# EAGLE design FlashAdapter_sfc (EAGLE 7.6.0)
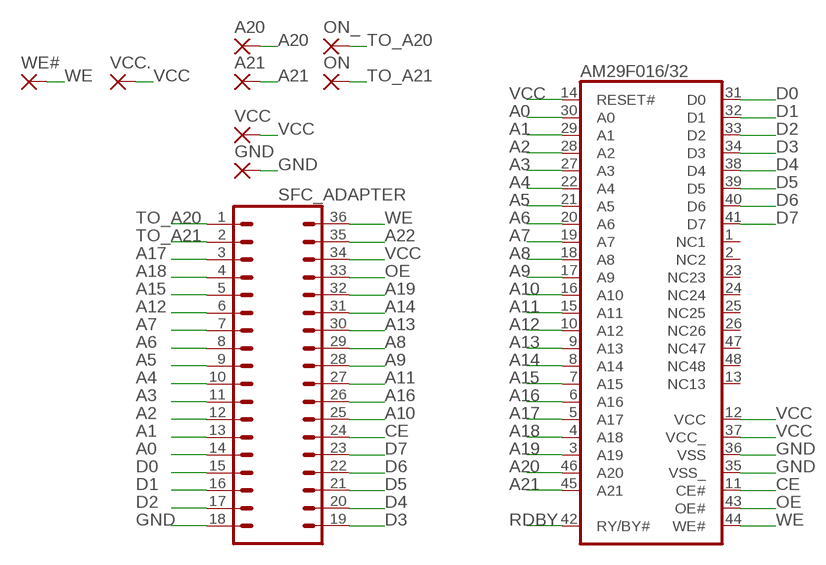
[diagram p0: schematic, sheet 1]

## Parts
A20  SMD2  [SMD1,27-2,54]
A21  SMD2  [SMD1,27-2,54]
AM29F016/32  AM29F016  [TSOP48]
GND  SMD2  [SMD1,27-2,54]
ON  SMD2  [SMD1,27-2,54]
ON_  SMD2  [SMD1,27-2,54]
SFC_ADAPTER  DIP36PTH  [DIP36]
VCC  SMD2  [SMD1,27-2,54]
VCC.  SMD2  [SMD1,27-2,54]
WE#  SMD2  [SMD1,27-2,54]

## Nets
A0: AM29F016/32.30(A0) SFC_ADAPTER.14
A1: AM29F016/32.29(A1) SFC_ADAPTER.13
A2: AM29F016/32.28(A2) SFC_ADAPTER.12
A3: AM29F016/32.27(A3) SFC_ADAPTER.11
A4: AM29F016/32.22(A4) SFC_ADAPTER.10
A5: AM29F016/32.21(A5) SFC_ADAPTER.9
A6: AM29F016/32.20(A6) SFC_ADAPTER.8
A7: AM29F016/32.19(A7) SFC_ADAPTER.7
A8: AM29F016/32.18(A8) SFC_ADAPTER.29
A9: AM29F016/32.17(A9) SFC_ADAPTER.28
A10: AM29F016/32.16(A10) SFC_ADAPTER.25
A11: AM29F016/32.15(A11) SFC_ADAPTER.27
A12: AM29F016/32.10(A12) SFC_ADAPTER.6
A13: AM29F016/32.9(A13) SFC_ADAPTER.30
A14: AM29F016/32.8(A14) SFC_ADAPTER.31
A15: AM29F016/32.7(A15) SFC_ADAPTER.5
A16: AM29F016/32.6(A16) SFC_ADAPTER.26
A17: AM29F016/32.5(A17) SFC_ADAPTER.3
A18: AM29F016/32.4(A18) SFC_ADAPTER.4
A19: AM29F016/32.3(A19) SFC_ADAPTER.32
A20: A20.1(P) AM29F016/32.46(A20)
A21: A21.1(P) AM29F016/32.45(A21)
A22: SFC_ADAPTER.35
CE: AM29F016/32.11(CE#) SFC_ADAPTER.24
D0: AM29F016/32.31(D0) SFC_ADAPTER.15
D1: AM29F016/32.32(D1) SFC_ADAPTER.16
D2: AM29F016/32.33(D2) SFC_ADAPTER.17
D3: AM29F016/32.34(D3) SFC_ADAPTER.19
D4: AM29F016/32.38(D4) SFC_ADAPTER.20
D5: AM29F016/32.39(D5) SFC_ADAPTER.21
D6: AM29F016/32.40(D6) SFC_ADAPTER.22
D7: AM29F016/32.41(D7) SFC_ADAPTER.23
GND: AM29F016/32.35(VSS_) AM29F016/32.36(VSS) GND.1(P) SFC_ADAPTER.18
OE: AM29F016/32.43(OE#) SFC_ADAPTER.33
RDBY: AM29F016/32.42(RY/BY#)
TO_A20: ON_.1(P) SFC_ADAPTER.1
TO_A21: ON.1(P) SFC_ADAPTER.2
VCC: AM29F016/32.12(VCC) AM29F016/32.14(RESET#) AM29F016/32.37(VCC_) SFC_ADAPTER.34 VCC.1(P) VCC..1(P)
WE: AM29F016/32.44(WE#) SFC_ADAPTER.36 WE#.1(P)
Unconnected: AM29F016/32.1(NC1) AM29F016/32.2(NC2) AM29F016/32.13(NC13) AM29F016/32.23(NC23) AM29F016/32.24(NC24) AM29F016/32.25(NC25) AM29F016/32.26(NC26) AM29F016/32.47(NC47) AM29F016/32.48(NC48)

## Library data of the parts
A20 A21 GND ON ON_ VCC VCC. WE# = wirepad:SMD2: SMD PAD
AM29F016/32 = Chip_AM29F016:AM29F016: 4-Megabit FLASH MEMORY (512 K x 8 bit/256 K x 16 bit) 5 V-only
SFC_ADAPTER = Adapter_DIP36:DIP36: 1x16 .1" header

## Board
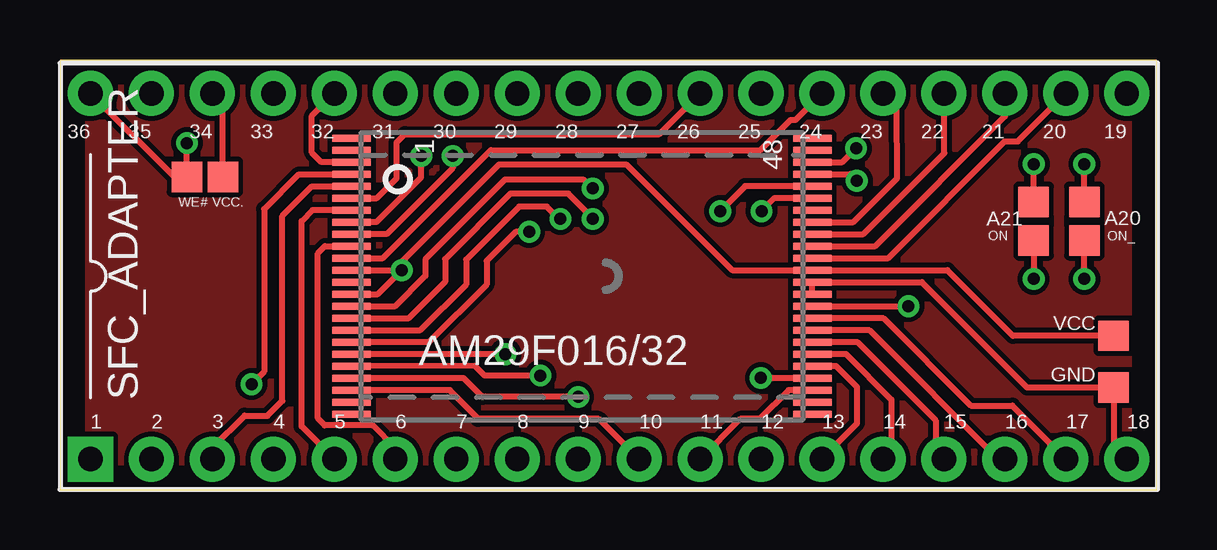
[diagram p1: board, top side]
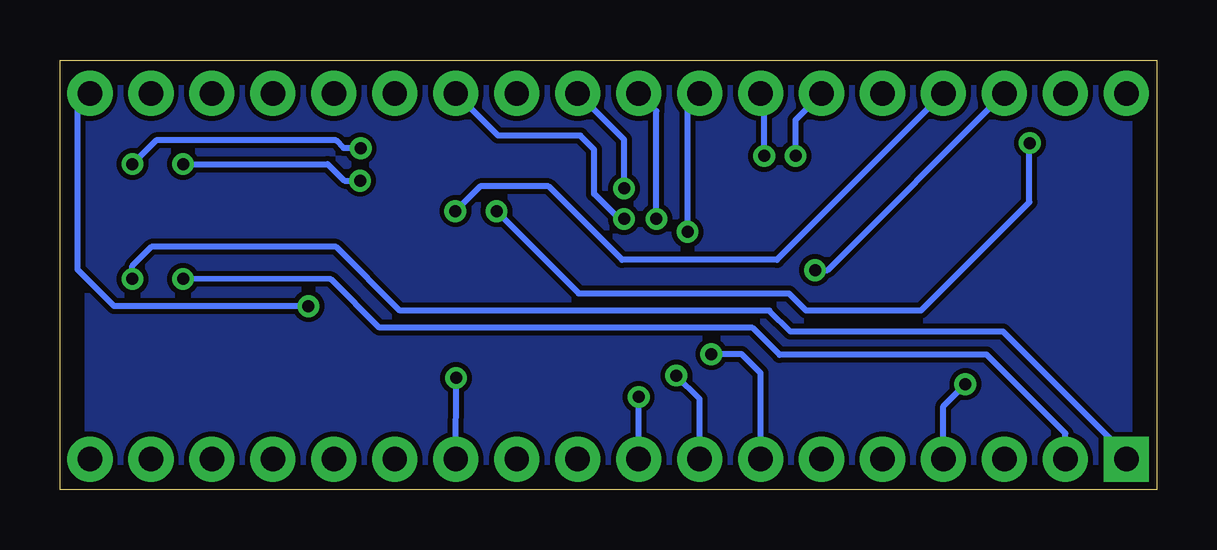
[diagram p2: board, bottom side, seen from below]

Size 45.7 x 17.9 mm. Coordinates in mm from the lower left corner, seen from the top.
Outline: 0,0 45.7,0 45.7,17.9 0,17.9 0,0
Copper layers (1*16): Top 0.035mm / dielectric 1.5mm / Bottom 0.035mm
Design rules "default": minimum track width 10mil, minimum drill 24mil, track to track 8mil, track to pad 8mil, pad to pad 8mil, via to via 8mil, smd to smd 8mil, copper to edge 40mil, drill to drill 8mil, minimum pad ring 10mil, minimum via ring 8mil, stop-mask expansion 4mil, vias tented up to drill 0mil, thermal gap 10mil

### Footprints (pad centres in the part's own frame; a part is rotated, then mirrored left to right if it is on the bottom)
SMD1,27-2,54 = smd 1.27 x 1.27: 1 0,0
TSOP48 = smd 0.3 x 1.6: 1 -5.75,-9.6; 2 -5.25,-9.6; 3 -4.75,-9.6; 4 -4.25,-9.6; 5 -3.75,-9.6; 6 -3.25,-9.6; 7 -2.75,-9.6; 8 -2.25,-9.6; 9 -1.75,-9.6; 10 -1.25,-9.6; 11 -0.75,-9.6; 12 -0.25,-9.6; 13 0.25,-9.6; 14 0.75,-9.6; 15 1.25,-9.6; 16 1.75,-9.6; 17 2.25,-9.6; 18 2.75,-9.6; 19 3.25,-9.6; 20 3.75,-9.6; 21 4.25,-9.6; 22 4.75,-9.6; 23 5.25,-9.6; 24 5.75,-9.6; 25 5.75,9.6; 26 5.25,9.6; 27 4.75,9.6; 28 4.25,9.6; 29 3.75,9.6; 30 3.25,9.6; 31 2.75,9.6; 32 2.25,9.6; 33 1.75,9.6; 34 1.25,9.6; 35 0.75,9.6; 36 0.25,9.6; 37 -0.25,9.6; 38 -0.75,9.6; 39 -1.25,9.6; 40 -1.75,9.6; 41 -2.25,9.6; 42 -2.75,9.6; 43 -3.25,9.6; 44 -3.75,9.6; 45 -4.25,9.6; 46 -4.75,9.6; 47 -5.25,9.6; 48 -5.75,9.6
DIP36 = drill 1.016 pad 1.88 square: 1 0,0 | drill 1.016 pad 1.88: 2 2.54,0; 3 5.08,0; 4 7.62,0; 5 10.16,0; 6 12.7,0; 7 15.24,0; 8 17.78,0; 9 20.32,0; 10 22.86,0; 11 25.4,0; 12 27.94,0; 13 30.48,0; 14 33.02,0; 15 35.56,0; 16 38.1,0; 17 40.64,0; 18 43.18,0; 19 43.18,15.24; 20 40.64,15.24; 21 38.1,15.24; 22 35.56,15.24; 23 33.02,15.24; 24 30.48,15.24; 25 27.94,15.24; 26 25.4,15.24; 27 22.86,15.24; 28 20.32,15.24; 29 17.78,15.24; 30 15.24,15.24; 31 12.7,15.24; 32 10.16,15.24; 33 7.62,15.24; 34 5.08,15.24; 35 2.54,15.24; 36 0,15.24

### Placement (x,y rotation side)
A20  42.68,11.99 90 top
A21  40.57,11.99 90 top
AM29F016/32  21.75,8.89 270 top
GND  43.9,4.25 90 top
ON  40.57,10.38 270 top
ON_  42.68,10.38 270 top
SFC_ADAPTER  1.27,1.27 0 top
VCC  43.9,6.41 90 top
VCC.  6.79,13.03 270 top
WE#  5.29,13.03 270 top

### Tracks (layer width: path | path; a pad name or v marks a point on that pad's centre or on a via)
A0
  Top 0.254: AM29F016/32.30 32.76,5.64 34.64,3.75 34.64,1.62 SFC_ADAPTER.14
A1
  Top 0.254: SFC_ADAPTER.13 31.75,1.31 33.21,2.77 33.21,4.27 32.34,5.14 AM29F016/32.29
A2  (via drill 0.5)
  Top 0.254: v29.2,4.65 31.34,4.65 AM29F016/32.28
  Bottom 0.254: SFC_ADAPTER.12 v29.2,4.65
A3
  Top 0.254: AM29F016/32.27 31.34,4.15 30.36,4.15 29.16,2.95 28.35,2.95 SFC_ADAPTER.11
A4
  Top 0.254: SFC_ADAPTER.10 24.09,1.3 22.44,2.95 17.42,2.95 16.24,4.14 AM29F016/32.22
A5  (via drill 0.5)
  Top 0.254: v21.59,3.86 17.6,3.86 16.82,4.64 AM29F016/32.21
  Bottom 0.254: SFC_ADAPTER.9 v21.59,3.86
A6  (via drill 0.5)
  Top 0.254: v20.02,4.75 17.69,4.75 17.29,5.15 AM29F016/32.20
  Bottom 0.254: SFC_ADAPTER.8 19.05,3.78 v20.02,4.75
A7  (via drill 0.5)
  Top 0.254: v18.56,5.64 AM29F016/32.19
  Bottom 0.254: SFC_ADAPTER.7 16.51,4.85 17.3,5.64 v18.56,5.64
A8  (via drill 0.5)
  Top 0.254: v19.55,10.74 18.99,10.74 17.78,9.53 17.78,8.54 15.37,6.13 AM29F016/32.18
  Bottom 0.254: v19.55,10.74 19.55,16.01 SFC_ADAPTER.29
A9  (via drill 0.5)
  Top 0.254: v20.85,11.28 20.77,11.31 20.29,11.79 19.13,11.79 16.92,9.58 16.92,8.54 15.02,6.64 AM29F016/32.17
  Bottom 0.254: v20.85,11.28 20.85,15.77 SFC_ADAPTER.28
A10  (via drill 0.5)
  Top 0.254: AM29F016/32.16 14.54,7.14 16.05,8.65 16.05,9.6 18.77,12.33 21.18,12.33 22.2,11.31 v22.2,11.28
  Bottom 0.254: v22.2,11.28 22.4,11.28 23.44,12.32 23.44,14.17 24.02,14.75 27.45,14.75 SFC_ADAPTER.25
A11  (via drill 0.5)
  Top 0.254: AM29F016/32.15 13.96,7.64 15.22,8.9 15.22,9.59 18.55,12.93 21.8,12.93 v22.2,12.55
  Bottom 0.254: v22.2,12.55 22.2,14.58 SFC_ADAPTER.27
A12
  Top 0.254: SFC_ADAPTER.6 13.97,1.73 13.03,2.68 11.03,2.68 10.74,2.97 10.74,9.84 11.04,10.14 AM29F016/32.10
A13  (via drill 0.5)
  Top 0.254: AM29F016/32.9 13.61,10.64 16.36,13.39 v16.36,13.9
  Bottom 0.254: v16.36,13.9 16.36,16.36 SFC_ADAPTER.30
A14  (via drill 0.5)
  Top 0.254: AM29F016/32.8 13.18,11.14 15.05,13.01 v15.05,13.9
  Bottom 0.254: v15.05,13.9 15.05,15.41 SFC_ADAPTER.31
A15
  Top 0.254: SFC_ADAPTER.5 10.07,2.63 10.07,11.19 10.53,11.65 12.14,11.65 AM29F016/32.7
A16
  Top 0.254: SFC_ADAPTER.26 24.97,14.81 14.37,14.81 14.02,14.46 14.02,12.96 13.2,12.14 AM29F016/32.6
A17
  Top 0.254: AM29F016/32.5 12.14,12.63 10.49,12.63 9.27,11.41 9.27,3.7 8.64,3.07 7.69,3.08 6.35,1.74 SFC_ADAPTER.3
A18  (via drill 0.5)
  Top 0.254: AM29F016/32.4 12.14,13.13 9.95,13.13 8.51,11.69 8.51,4.92 v7.98,4.39
  Bottom 0.254: SFC_ADAPTER.4 8.89,3.48 v7.98,4.39
A19
  Top 0.254: AM29F016/32.3 10.89,13.64 10.49,14.04 10.49,15.57 SFC_ADAPTER.32
A20  (via drill 0.5)
  Top 0.254: AM29F016/32.46 32.59,13.64 v33.17,14.22 | A20.1 v42.68,13.56
  Bottom 0.254: v33.17,14.22 v33.16,14.23 33.88,14.23 34.2,14.55 41.7,14.55 v42.68,13.56
A21  (via drill 0.5)
  Top 0.254: A21.1 v40.58,13.56 | AM29F016/32.45 32.92,13.14 v33.2,12.87
  Bottom 0.254: v40.58,13.56 34.55,13.56 33.85,12.87 v33.2,12.87
CE
  Top 0.254: AM29F016/32.11 13.45,9.64 17.95,14.14 29.18,14.14 30.45,15.41 30.65,15.41 SFC_ADAPTER.24
D0
  Top 0.254: AM29F016/32.31 33.24,6.13 36.48,2.88 36.48,1.62 SFC_ADAPTER.15
D1
  Top 0.254: AM29F016/32.32 33.73,6.63 39.09,1.27 SFC_ADAPTER.16
D2
  Top 0.254: AM29F016/32.33 34.32,7.13 37.95,3.5 39.68,3.5 SFC_ADAPTER.17
D3  (via drill 0.5)
  Top 0.254: AM29F016/32.34 v35.35,7.64
  Bottom 0.254: v35.35,7.64 43.44,7.64 44.97,9.17 44.97,15.99 SFC_ADAPTER.19
D4
  Top 0.254: AM29F016/32.38 34.5,9.64 39.37,14.51 39.91,14.51 SFC_ADAPTER.20
D5
  Top 0.254: AM29F016/32.39 33.96,10.14 39.37,15.55 SFC_ADAPTER.21
D6
  Top 0.254: AM29F016/32.40 33.47,10.64 36.85,14.02 36.85,16.49 SFC_ADAPTER.22
D7
  Top 0.254: AM29F016/32.41 33.05,11.14 34.88,12.97 34.87,15.93 SFC_ADAPTER.23
GND
  Top 0.254: AM29F016/32.35 AM29F016/32.36 35.91,8.64 40.3,4.25 GND.1 43.9,1.82 SFC_ADAPTER.18
N$1
  pour Bottom: 0,0 0,17.78 45.72,17.78 45.72,0
N$2
  pour Top: 0,0 45.72,0 45.72,17.78 0,17.78
OE  (via drill 0.5)
  Top 0.254: AM29F016/32.43 29.77,12.14 v29.23,11.6
  Bottom 0.254: SFC_ADAPTER.33 15.83,9.57 22.28,9.57 25.34,12.63 28.2,12.63 v29.23,11.6
TO_A20  (via drill 0.5)
  Top 0.254: v42.68,8.78 ON_.1
  Bottom 0.254: SFC_ADAPTER.1 1.27,1.45 6.4,6.58 15.26,6.58 16.14,7.46 31.54,7.46 34.19,10.11 41.89,10.11 42.68,9.32 v42.68,8.78
TO_A21  (via drill 0.5)
  Top 0.254: ON.1 v40.57,8.78
  Bottom 0.254: SFC_ADAPTER.2 3.81,2.34 7.09,5.62 15.72,5.61 16.84,6.74 32.39,6.75 34.4,8.76 v40.57,8.78
VCC  (via drill 0.5)
  Top 0.254: AM29F016/32.12 v14.24,9.14 | v14.24,9.14 14.24,9.49 18.3,13.55 23.59,13.55 28,9.14 AM29F016/32.37 36.97,9.14 39.7,6.41 VCC.1 | AM29F016/32.14 13.24,8.14 v14.24,9.14 | VCC..1 6.79,16.07 SFC_ADAPTER.34
  Bottom 0.254: v14.24,9.14 13.72,9.14 SFC_ADAPTER.34
WE  (via drill 0.5)
  Top 0.254: v5.29,14.44 WE#.1 4.75,13.03 SFC_ADAPTER.36 | AM29F016/32.44 28.55,12.64 v27.51,11.6
  Bottom 0.254: v27.51,11.6 24.09,8.18 15.33,8.18 14.62,7.47 9.82,7.47 5.31,11.98 5.31,14.42 v5.29,14.44